# Altium schematic sheet 09.SchDoc
size 297 x 209 mm
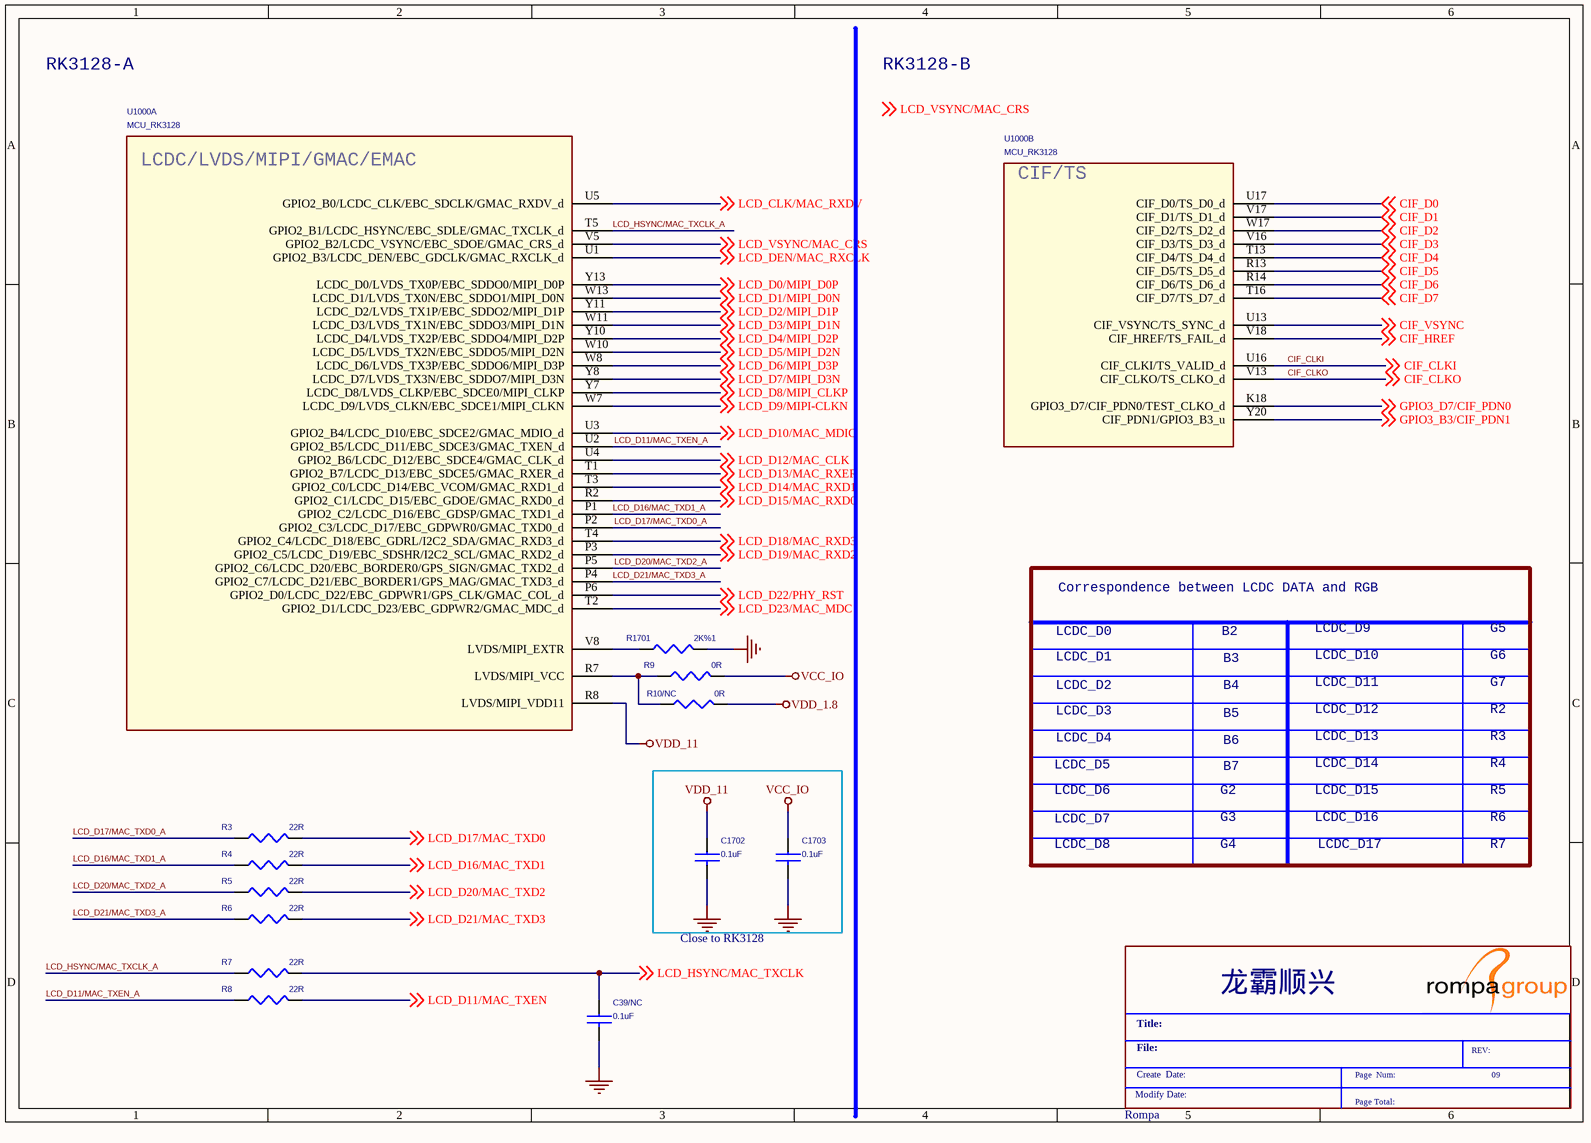
[diagram p0: 09.SchDoc]

## Parts
*  Rompa  Schematic Page Number: 09  (graphical)
C39/NC  0.1uF  [C0402]
C1702  0.1uF  [C0402]
C1703  0.1uF  [C0402]
R3  22R  [R0402]
R4  22R  [R0402]
R5  22R  [R0402]
R6  22R  [R0402]
R7  22R  [R0402]
R8  22R  [R0402]
R9  0R  [R0402]
R10/NC  0R  [R0402]
R1701  2K%1  [R0402]
U1000  MCU_RK3128  [BGA316-14X14-0.65]  (parts A,B of 12)

## Nets
GND: C39/NC.2 C1702.2 C1703.2 R1701.2
VCC_IO: C1703.1 R9.2
VDD_1.8: R10/NC.2
VDD_11: C1702.1 U1000.R8(LVDS/MIPI_VDD11)
CIF_CLKI: U1000.U16(CIF_CLKI/TS_VALID_d) ; off-sheet CIF_CLKI
CIF_CLKO: U1000.V13(CIF_CLKO/TS_CLKO_d) ; off-sheet CIF_CLKO
CIF_D0: U1000.U17(CIF_D0/TS_D0_d) ; off-sheet CIF_D0
CIF_D1: U1000.V17(CIF_D1/TS_D1_d) ; off-sheet CIF_D1
CIF_D2: U1000.W17(CIF_D2/TS_D2_d) ; off-sheet CIF_D2
CIF_D3: U1000.V16(CIF_D3/TS_D3_d) ; off-sheet CIF_D3
CIF_D4: U1000.T13(CIF_D4/TS_D4_d) ; off-sheet CIF_D4
CIF_D5: U1000.R13(CIF_D5/TS_D5_d) ; off-sheet CIF_D5
CIF_D6: U1000.R14(CIF_D6/TS_D6_d) ; off-sheet CIF_D6
CIF_D7: U1000.T16(CIF_D7/TS_D7_d) ; off-sheet CIF_D7
CIF_HREF: U1000.V18(CIF_HREF/TS_FAIL_d) ; off-sheet CIF_HREF
CIF_VSYNC: U1000.U13(CIF_VSYNC/TS_SYNC_d) ; off-sheet CIF_VSYNC
GPIO3_B3/CIF_PDN1: U1000.Y20(CIF_PDN1/GPIO3_B3_u) ; off-sheet GPIO3_B3/CIF_PDN1
GPIO3_D7/CIF_PDN0: U1000.K18(GPIO3_D7/CIF_PDN0/TEST_CLKO_d) ; off-sheet GPIO3_D7/CIF_PDN0
LCD_CLK/MAC_RXDV: U1000.U5(GPIO2_B0/LCDC_CLK/EBC_SDCLK/GMAC_RXDV_d) ; off-sheet LCD_CLK/MAC_RXDV
LCD_D0/MIPI_D0P: U1000.Y13(LCDC_D0/LVDS_TX0P/EBC_SDDO0/MIPI_D0P) ; off-sheet LCD_D0/MIPI_D0P
LCD_D1/MIPI_D0N: U1000.W13(LCDC_D1/LVDS_TX0N/EBC_SDDO1/MIPI_D0N) ; off-sheet LCD_D1/MIPI_D0N
LCD_D2/MIPI_D1P: U1000.Y11(LCDC_D2/LVDS_TX1P/EBC_SDDO2/MIPI_D1P) ; off-sheet LCD_D2/MIPI_D1P
LCD_D3/MIPI_D1N: U1000.W11(LCDC_D3/LVDS_TX1N/EBC_SDDO3/MIPI_D1N) ; off-sheet LCD_D3/MIPI_D1N
LCD_D4/MIPI_D2P: U1000.Y10(LCDC_D4/LVDS_TX2P/EBC_SDDO4/MIPI_D2P) ; off-sheet LCD_D4/MIPI_D2P
LCD_D5/MIPI_D2N: U1000.W10(LCDC_D5/LVDS_TX2N/EBC_SDDO5/MIPI_D2N) ; off-sheet LCD_D5/MIPI_D2N
LCD_D6/MIPI_D3P: U1000.W8(LCDC_D6/LVDS_TX3P/EBC_SDDO6/MIPI_D3P) ; off-sheet LCD_D6/MIPI_D3P
LCD_D7/MIPI_D3N: U1000.Y8(LCDC_D7/LVDS_TX3N/EBC_SDDO7/MIPI_D3N) ; off-sheet LCD_D7/MIPI_D3N
LCD_D8/MIPI_CLKP: U1000.Y7(LCDC_D8/LVDS_CLKP/EBC_SDCE0/MIPI_CLKP) ; off-sheet LCD_D8/MIPI_CLKP
LCD_D9/MIPI-CLKN: U1000.W7(LCDC_D9/LVDS_CLKN/EBC_SDCE1/MIPI_CLKN) ; off-sheet LCD_D9/MIPI-CLKN
LCD_D10/MAC_MDIO: U1000.U3(GPIO2_B4/LCDC_D10/EBC_SDCE2/GMAC_MDIO_d) ; off-sheet LCD_D10/MAC_MDIO
LCD_D11/MAC_TXEN: R8.2 ; off-sheet LCD_D11/MAC_TXEN
LCD_D11/MAC_TXEN_A: R8.1 U1000.U2(GPIO2_B5/LCDC_D11/EBC_SDCE3/GMAC_TXEN_d)
LCD_D12/MAC_CLK: U1000.U4(GPIO2_B6/LCDC_D12/EBC_SDCE4/GMAC_CLK_d) ; off-sheet LCD_D12/MAC_CLK
LCD_D13/MAC_RXER: U1000.T1(GPIO2_B7/LCDC_D13/EBC_SDCE5/GMAC_RXER_d) ; off-sheet LCD_D13/MAC_RXER
LCD_D14/MAC_RXD1: U1000.T3(GPIO2_C0/LCDC_D14/EBC_VCOM/GMAC_RXD1_d) ; off-sheet LCD_D14/MAC_RXD1
LCD_D15/MAC_RXD0: U1000.R2(GPIO2_C1/LCDC_D15/EBC_GDOE/GMAC_RXD0_d) ; off-sheet LCD_D15/MAC_RXD0
LCD_D16/MAC_TXD1: R4.2 ; off-sheet LCD_D16/MAC_TXD1
LCD_D16/MAC_TXD1_A: R4.1 U1000.P1(GPIO2_C2/LCDC_D16/EBC_GDSP/GMAC_TXD1_d)
LCD_D17/MAC_TXD0: R3.2 ; off-sheet LCD_D17/MAC_TXD0
LCD_D17/MAC_TXD0_A: R3.1 U1000.P2(GPIO2_C3/LCDC_D17/EBC_GDPWR0/GMAC_TXD0_d)
LCD_D18/MAC_RXD3: U1000.T4(GPIO2_C4/LCDC_D18/EBC_GDRL/I2C2_SDA/GMAC_RXD3_d) ; off-sheet LCD_D18/MAC_RXD3
LCD_D19/MAC_RXD2: U1000.P3(GPIO2_C5/LCDC_D19/EBC_SDSHR/I2C2_SCL/GMAC_RXD2_d) ; off-sheet LCD_D19/MAC_RXD2
LCD_D20/MAC_TXD2: R5.2 ; off-sheet LCD_D20/MAC_TXD2
LCD_D20/MAC_TXD2_A: R5.1 U1000.P5(GPIO2_C6/LCDC_D20/EBC_BORDER0/GPS_SIGN/GMAC_TXD2_d)
LCD_D21/MAC_TXD3: R6.2 ; off-sheet LCD_D21/MAC_TXD3
LCD_D21/MAC_TXD3_A: R6.1 U1000.P4(GPIO2_C7/LCDC_D21/EBC_BORDER1/GPS_MAG/GMAC_TXD3_d)
LCD_D22/PHY_RST: U1000.P6(GPIO2_D0/LCDC_D22/EBC_GDPWR1/GPS_CLK/GMAC_COL_d) ; off-sheet LCD_D22/PHY_RST
LCD_D23/MAC_MDC: U1000.T2(GPIO2_D1/LCDC_D23/EBC_GDPWR2/GMAC_MDC_d) ; off-sheet LCD_D23/MAC_MDC
LCD_DEN/MAC_RXCLK: U1000.U1(GPIO2_B3/LCDC_DEN/EBC_GDCLK/GMAC_RXCLK_d) ; off-sheet LCD_DEN/MAC_RXCLK
LCD_HSYNC/MAC_TXCLK: C39/NC.1 R7.2 ; off-sheet LCD_HSYNC/MAC_TXCLK
LCD_HSYNC/MAC_TXCLK_A: R7.1 U1000.T5(GPIO2_B1/LCDC_HSYNC/EBC_SDLE/GMAC_TXCLK_d)
LCD_VSYNC/MAC_CRS: U1000.V5(GPIO2_B2/LCDC_VSYNC/EBC_SDOE/GMAC_CRS_d) ; off-sheet LCD_VSYNC/MAC_CRS
NetR9_1: R9.1 R10/NC.1 U1000.R7(LVDS/MIPI_VCC)
NetR1701_1: R1701.1 U1000.V8(LVDS/MIPI_EXTR)

## Notes on the sheet
- RK3128-A
- RK3128-B
- Correspondence between LCDC DATA and RGB
- LCDC_D0
- LCDC_D1
- B2
- B3
- LCDC_D10
- LCDC_D9
- G5
- G6
- LCDC_D3
- LCDC_D4
- LCDC_D2
- B4
- B6
- B5
- LCDC_D13
- LCDC_D12
- LCDC_D11
- R3
- R2
- G7
- LCDC_D6
- LCDC_D5
- G2
- B7
- LCDC_D15
- LCDC_D14
- R5
- R4
- LCDC_D7
- LCDC_D8
- G3
- G4
- LCDC_D16
- LCDC_D17
- R7
- R6
- Close to RK3128
- Labels drawn without touching a wire or pin: LCD_VSYNC/MAC_CRS
- (in symbol MCU_RK3128, part A) LCDC/LVDS/MIPI/GMAC/EMAC
- (in symbol MCU_RK3128, part B) CIF/TS
- (in symbol Rompa) 龙霸顺兴; Title:; File:; REV:; Create  Date:; Page  Num:; Modify Date:; Page Total:

## Library data of the parts
C39/NC C1702 C1703 = CAP NP: RoHS CHIP CAP 0.1uF +10/-10% X7R
R3-R9 R1701 = RES 1B: ROHS CHIP RES 4.7K 1/16W 5%
R10/NC = RES 1B: NC/ 0R; Descript: NC/0R